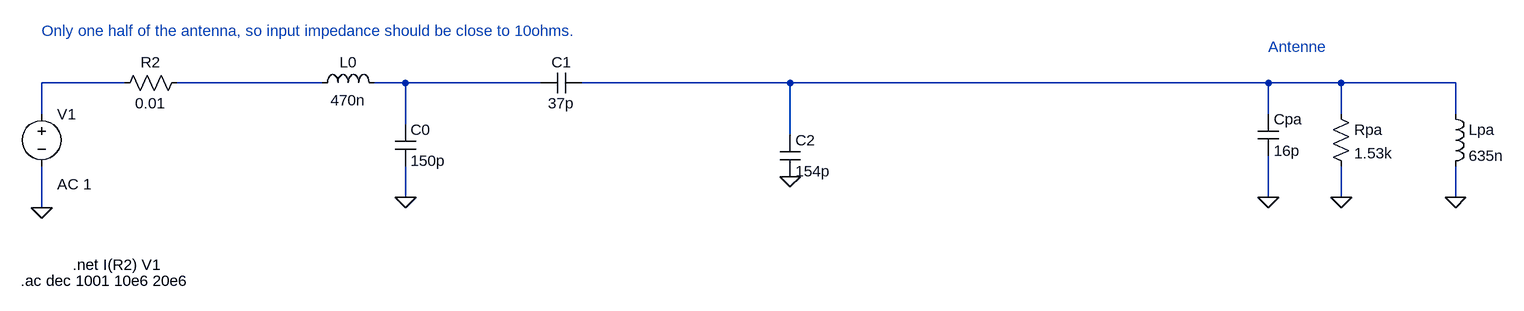
[diagram p0: schematic single_ended_NFC-simulation.asc]
single_ended_NFC-simulation.asc, the LTspice schematic file:
Version 4
SHEET 1 1764 692
WIRE -368 48 -496 48
WIRE -64 48 -288 48
WIRE 64 48 16 48
WIRE 272 48 64 48
WIRE 656 48 336 48
WIRE 1392 48 656 48
WIRE 1504 48 1392 48
WIRE 1680 48 1504 48
WIRE -496 96 -496 48
WIRE 1392 96 1392 48
WIRE 1504 96 1504 48
WIRE 1680 96 1680 48
WIRE 64 112 64 48
WIRE 656 128 656 48
WIRE 64 224 64 176
WIRE 1392 224 1392 160
WIRE 1504 224 1504 176
WIRE 1680 224 1680 176
WIRE -496 240 -496 176
FLAG -496 240 0
FLAG 64 224 0
FLAG 1680 224 0
FLAG 1504 224 0
FLAG 1392 224 0
FLAG 656 192 0
SYMBOL voltage -496 80 R0
WINDOW 123 24 124 Left 2
WINDOW 39 0 0 Left 0
SYMATTR Value2 AC 1
SYMATTR InstName V1
SYMATTR Value ""
SYMBOL ind -80 64 R270
WINDOW 0 32 56 VTop 2
WINDOW 3 5 56 VBottom 2
SYMATTR InstName L0
SYMATTR Value 470n
SYMBOL cap 48 112 R0
SYMATTR InstName C0
SYMATTR Value 150p
SYMBOL cap 336 32 R90
WINDOW 0 0 32 VBottom 2
WINDOW 3 32 32 VTop 2
SYMATTR InstName C1
SYMATTR Value 37p
SYMBOL ind 1664 80 R0
SYMATTR InstName Lpa
SYMATTR Value 635n
SYMBOL cap 640 128 R0
SYMATTR InstName C2
SYMATTR Value 154p
SYMBOL res -272 32 R90
WINDOW 0 0 56 VBottom 2
WINDOW 3 32 56 VTop 2
SYMATTR InstName R2
SYMATTR Value 0.01
SYMBOL res 1488 80 R0
SYMATTR InstName Rpa
SYMATTR Value 1.53k
SYMBOL cap 1376 96 R0
SYMATTR InstName Cpa
SYMATTR Value 16p
TEXT -448 328 Left 2 !.net I(R2) V1
TEXT -528 352 Left 2 !.ac dec 1001 10e6 20e6
TEXT -496 -32 Left 2 ;Only one half of the antenna, so input impedance should be close to 10ohms.
TEXT 1392 -8 Left 2 ;Antenne

The netlist it stands for:
* single_ended_NFC-simulation.asc
V1 N001 0 AC 1
L0 N002 N003 470n
C0 N003 0 150p
C1 N004 N003 37p
Lpa N004 0 635n
C2 N004 0 154p
R2 N002 N001 0.01
Rpa N004 0 1.53k
Cpa N004 0 16p
.net I(R2) V1
.ac dec 1001 10e6 20e6
* Only one half of the antenna, so input impedance should be close to 10ohms.
* Antenne
.backanno
.end